# EAGLE design smartBadgeN (EAGLE 9.4.2)
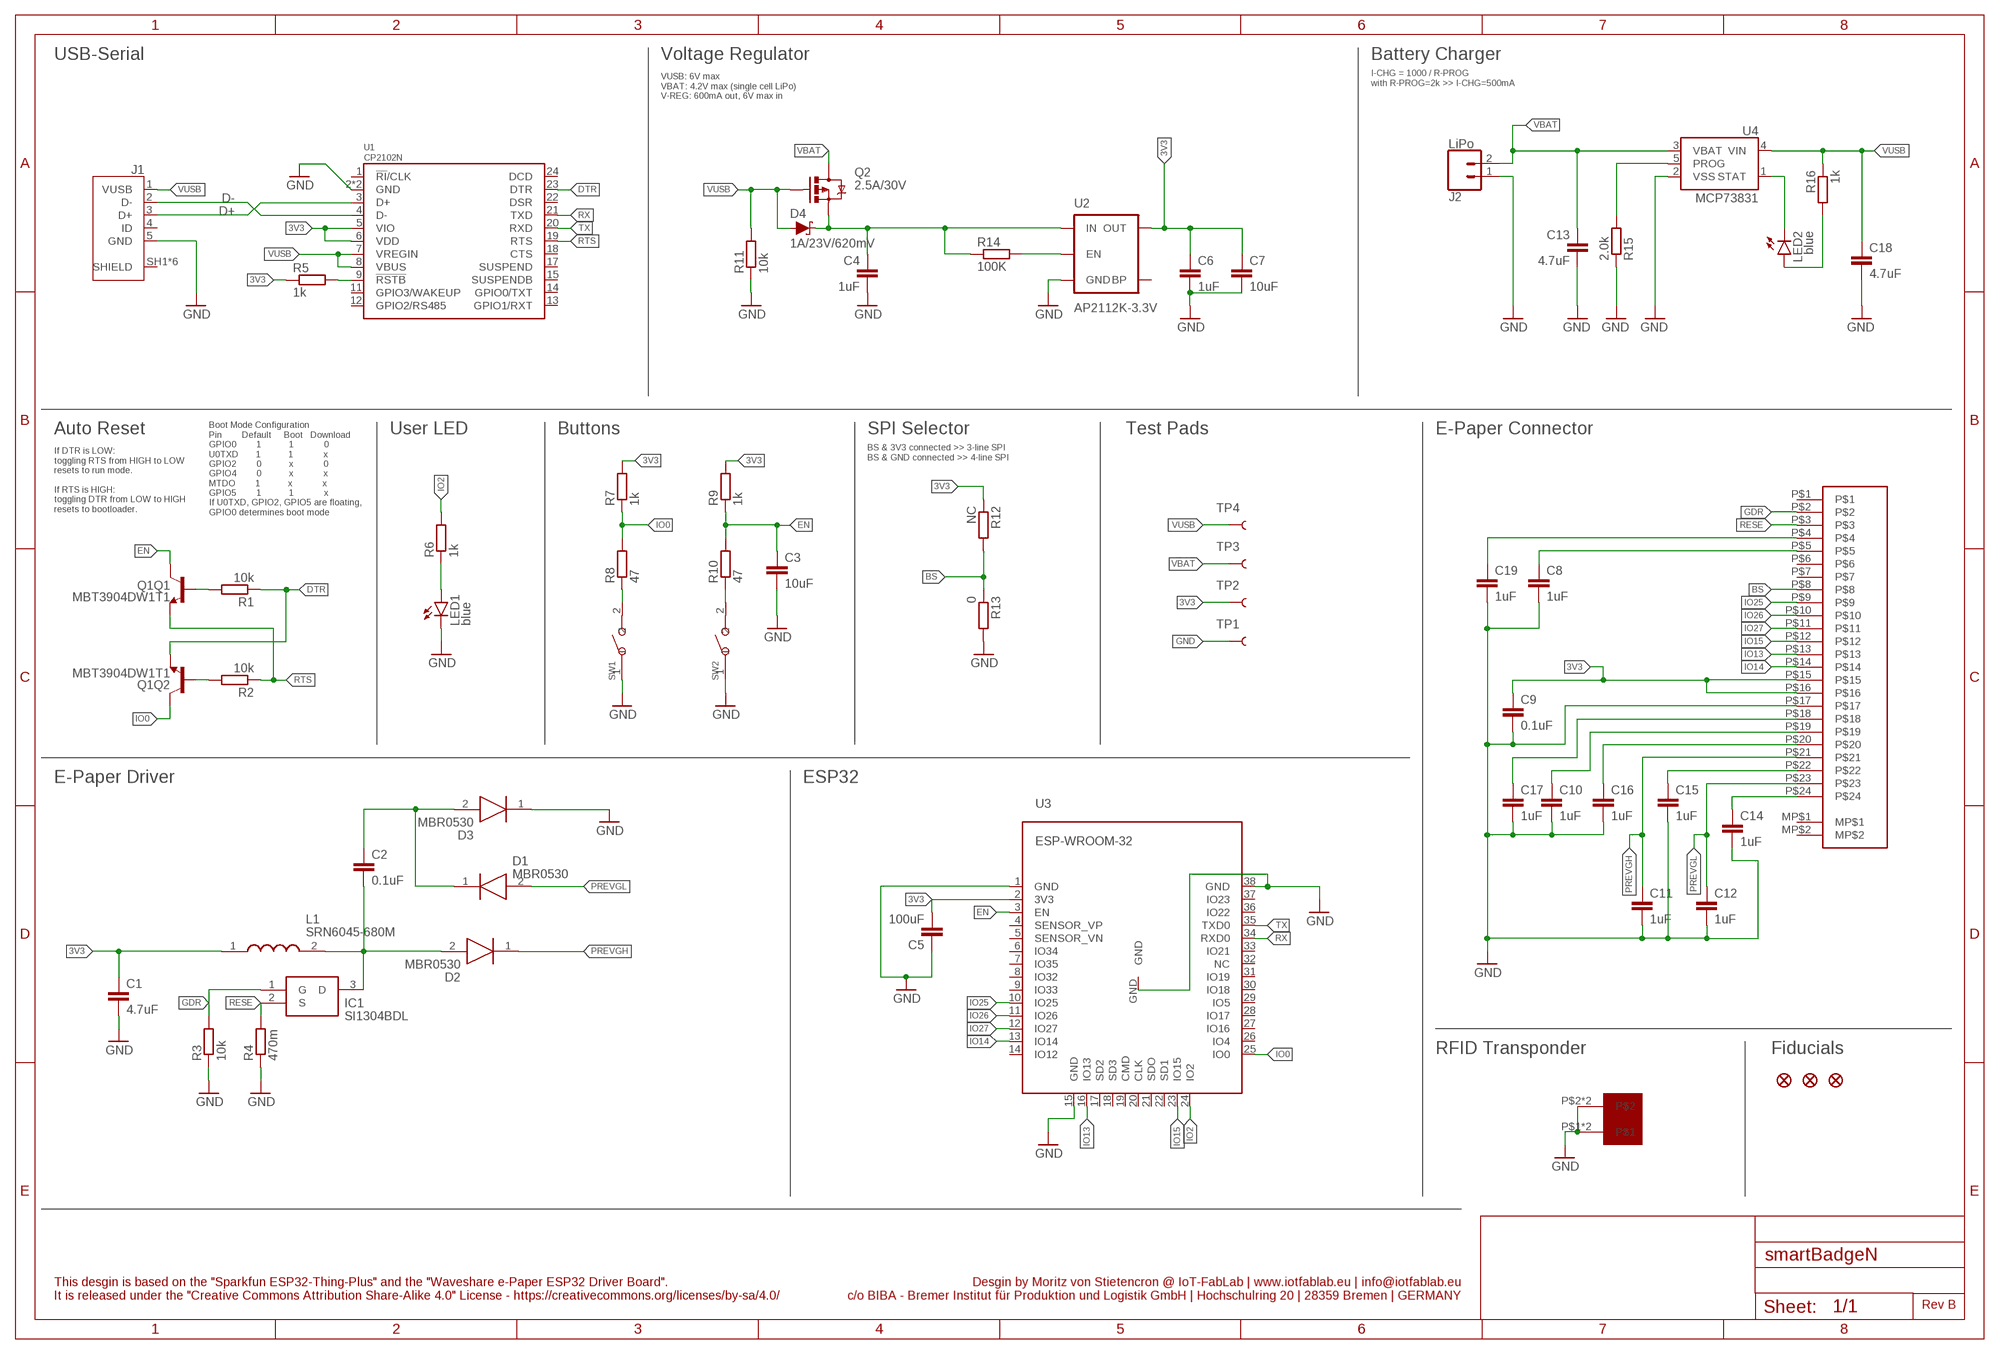
[diagram p0: schematic, sheet 1]

## Parts
C1  4.7uF  C-EUC0603  [C0603]
C2  0.1uF  C-EUC0603  [C0603]
C3  10uF  C-EUC0603  [C0603]
C4  1uF  C-EUC0603  [C0603]
C5  100uF  C-EUC1206  [C1206]
C6  1uF  C-EUC0603  [C0603]
C7  10uF  C-EUC0603  [C0603]
C8  1uF  C-EUC0603  [C0603]
C9  0.1uF  C-EUC0603  [C0603]
C10  1uF  C-EUC0603  [C0603]
C11  1uF  C-EUC0603  [C0603]
C12  1uF  C-EUC0603  [C0603]
C13  4.7uF  C-EUC0603  [C0603]
C14  1uF  C-EUC0603  [C0603]
C15  1uF  C-EUC0603  [C0603]
C16  1uF  C-EUC0603  [C0603]
C17  1uF  C-EUC0603  [C0603]
C18  4.7uF  C-EUC0603  [C0603]
C19  1uF  C-EUC0603  [C0603]
D1  MBR0530  [SOD3716X135N]
D2  MBR0530  [SOD3716X135N]
D3  MBR0530  [SOD3716X135N]
D4  1A/23V/620mV  DIODE-SCHOTTKY-BAT20J  [SOD-323]
EPD  MOLEX-FPC-CONN-24X0.5  [MOLEX-0512812494]
FD1  FIDUCIAL1X2  [FIDUCIAL-1X2]
FD2  FIDUCIAL1X2  [FIDUCIAL-1X2]
FD3  FIDUCIAL1X2  [FIDUCIAL-1X2]
IC1  SI1304BDL  SI1304BDL-T1-E3  [SOT65P210X110-3N]
J1  10118192-0001LF  [AMPHENOL_10118192-0001LF]
J2  LiPo  CONN_02-JST-2MM-SMT  [JST-2-SMD]
L1  SRN6045-680M  [INDPM6060X470N]
LED1  blue  LEDCHIP-LED0603  [CHIP-LED0603]
LED2  blue  LEDCHIP-LED0603  [CHIP-LED0603]
Q1  MBT3904DW1T1  TRANS_NPN_DUAL-MBT3904DW1T1  [SC70-6]
Q2  2.5A/30V  MOSFET-PCHANNELDMG2307L  [SOT23-3@1]
R1  10k  R-EU_R0603  [R0603]
R2  10k  R-EU_R0603  [R0603]
R3  10k  R-EU_R0603  [R0603]
R4  470m  R-EU_R0603  [R0603]
R5  1k  R-EU_R0603  [R0603]
R6  1k  R-EU_R0603  [R0603]
R7  1k  R-EU_R0603  [R0603]
R8  47  R-EU_R0603  [R0603]
R9  1k  R-EU_R0603  [R0603]
R10  47  R-EU_R0603  [R0603]
R11  10k  R-EU_R0603  [R0603]
R12  NC  R-EU_R0603  [R0603]
R13  0  R-EU_R0603  [R0603]
R14  100K  R-EU_R0603  [R0603]
R15  2.0k  R-EU_R0603  [R0603]
R16  1k  R-EU_R0603  [R0603]
RFID1  LXMS21ACMF-183  [LXMS21ACMF-183]
SW1  SMD-BUTTON(2P-3.0X2.5X1.2+0.4MM)-B3U-1000P-2P-SMD  [SW2-2.6-3.0X2.5X1.2+0.4MM]
SW2  SMD-BUTTON(2P-3.0X2.5X1.2+0.4MM)-B3U-1000P-2P-SMD  [SW2-2.6-3.0X2.5X1.2+0.4MM]
TP1  TEST-POINT3  [PAD.03X.03]
TP2  TEST-POINT3  [PAD.03X.03]
TP3  TEST-POINT3  [PAD.03X.03]
TP4  TEST-POINT3  [PAD.03X.03]
U1  CP2102N  [QFN24]
U2  AP2112K-3.3V  V_REG_LDOSMD  [SOT23-5]
U3  ESP-WROOM-32  [ESP-WROOM-32]
U4  MCP73831  [SOT23-5]

## Nets
3V3 [VDD]: C1.1 C5.2 C6.1 C7.1 C9.1 EPD.P$15 EPD.P$16 L1.1 R5.1 R7.2 R9.2 R12.1 TP2.P$1 U1.5(VIO) U1.6(VDD) U2.5(OUT) U3.2(3V3)
BS: EPD.P$8 R12.2 R13.1
BTN1: R10.1 SW2.2
CHG: LED2.C U4.1(STAT)
D+: J1.3(D+) U1.3(D+)
D-: J1.2(D-) U1.4(D-)
DTR: Q1.1(Q2:E) R1.1 U1.23(DTR)
EN: C3.1 Q1.3(Q1:C) R9.1 R10.2 U3.3(EN)
EN1: R14.2 U2.3(EN)
GDR: EPD.P$2 IC1.1(G) R3.2
GND [gnd]: C1.2 C3.2 C4.2 C5.1 C6.2 C7.2 C8.2 C9.2 C10.2 C11.2 C12.2 C13.2 C14.2 C15.2 C16.2 C17.2 C18.2 C19.2 D3.1(K) EPD.P$17 J1.5(GND) J2.1 LED1.C R3.1 R4.1 R11.1 R13.2 R15.1 RFID1.P$1 RFID1.P$2 RFID1.P$3 RFID1.P$4 SW1.1 SW2.1 TP1.P$1 U1.2(GND) U1.PAD(GND) U2.2(GND) U3.1(GND) U3.15(GND) U3.38(GND) U3.GND U4.2(VSS)
IO0: Q1.6(Q2:C) R7.1 R8.2 U3.25(IO0)
IO2: R6.2 U3.24(IO2)
IO13: EPD.P$13 U3.16(IO13)
IO14: EPD.P$14 U3.13(IO14)
IO15: EPD.P$12 U3.23(IO15)
IO25: EPD.P$9 U3.10(IO25)
IO26: EPD.P$10 U3.11(IO26)
IO27: EPD.P$11 U3.12(IO27)
N$1: R5.2 U1.9(!RSTB)
N$2: C17.1 EPD.P$18
N$3: C10.1 EPD.P$19
N$4: LED2.A R16.2
N$5: R15.2 U4.5(PROG)
N$6: Q1.5(Q1:B) R1.2
N$7: LED1.A R6.1
N$8: C19.1 EPD.P$4
N$9: C8.1 EPD.P$5
N$10: C16.1 EPD.P$20
N$12: C15.1 EPD.P$22
N$14: C14.1 EPD.P$24
N$17: C2.1 D1.1(K) D3.2(A)
N$18: C2.2 D2.2(A) IC1.3(D) L1.2
N$21: R8.1 SW1.2
N$22: Q1.2(Q2:B) R2.2
PREVGH: C11.1 D2.1(K) EPD.P$21
PREVGL: C12.1 D1.2(A) EPD.P$23
RESE: EPD.P$3 IC1.2(S) R4.2
RTS: Q1.4(Q1:E) R2.1 U1.19(RTS)
RX: U1.21(TXD) U3.34(RXD0)
TX: U1.20(RXD) U3.35(TXD0)
VBAT [VDD]: C13.1 J2.2 Q2.3(D) TP3.P$1 U4.3(VBAT)
VIN [VDD]: C4.1 D4.C Q2.2(S) R14.1 U2.1(IN)
VUSB [VDD]: C18.1 D4.A J1.1(VUSB) Q2.1(G) R11.2 R16.1 TP4.P$1 U1.7(VREGIN) U1.8(VBUS) U4.4(VIN)
Unconnected: EPD.MP$1 EPD.MP$2 EPD.P$1 EPD.P$6 EPD.P$7 J1.4(ID) J1.SH1(SHIELD) J1.SH2(SHIELD) J1.SH3(SHIELD) J1.SH4(SHIELD) J1.SH5(SHIELD) J1.SH6(SHIELD) U1.1(!RI!/CLK) U1.11(GPIO3/WAKEUP) U1.12(GPIO2/RS485) U1.13(GPIO1/RXT) U1.14(GPIO0/TXT) U1.15(SUSPENDB) U1.17(SUSPEND) U1.18(CTS) U1.22(DSR) U1.24(DCD) U2.4(BP) U3.4(SENSOR_VP) U3.5(SENSOR_VN) U3.6(IO34) U3.7(IO35) U3.8(IO32) U3.9(IO33) U3.14(IO12) U3.17(SD2) U3.18(SD3) U3.19(CMD) U3.20(CLK) U3.21(SDO) U3.22(SD1) U3.26(IO4) U3.27(IO16) U3.28(IO17) U3.29(IO5) U3.30(IO18) U3.31(IO19) U3.32(NC) U3.33(IO21) U3.36(IO22) U3.37(IO23)

## Notes on the sheet
- USB-Serial | Voltage Regulator | Battery Charger
- VUSB: 6V max
  VBAT: 4.2V max (single cell LiPo)
  V-REG: 600mA out, 6V max in
- I-CHG = 1000 / R-PROG
  with R-PROG=2k >> I-CHG=500mA
- Boot Mode Configuration
  Pin        Default     Boot   Download
  GPIO0        1           1            0
  U0TXD       1           1            x
  GPIO2        0           x            0
  GPIO4        0           x            x
  MTDO        1           x            x
  GPIO5        1           1            x
  If U0TXD, GPIO2, GPIO5 are floating, 
  GPIO0 determines boot mode
- Auto Reset | User LED | Buttons | SPI Selector | Test Pads | E-Paper Connector
- If DTR is LOW:
  toggling RTS from HIGH to LOW 
  resets to run mode.
  
  If RTS is HIGH:
  toggling DTR from LOW to HIGH
  resets to bootloader.
- BS & 3V3 connected >> 3-line SPI
  BS & GND connected >> 4-line SPI
- E-Paper Driver | ESP32
- RFID Transponder | Fiducials
- This desgin is based on the "Sparkfun ESP32-Thing-Plus" and the "Waveshare e-Paper ESP32 Driver Board".
  It is released under the "Creative Commons Attribution Share-Alike 4.0" License - https://creativecommons.org/licenses/by-sa/4.0/
- Desgin by Moritz von Stietencron @ IoT-FabLab | www.iotfablab.eu | info@iotfablab.eu
  c/o BIBA - Bremer Institut für Produktion und Logistik GmbH | Hochschulring 20 | 28359 Bremen | GERMANY
- Rev B

## Library data of the parts
C1-C19 = resistor:C-EU: CAPACITOR, European symbol
D1-D3 = SamacSys_Parts:MBR0530: ON SEMICONDUCTOR - MBR0530 - DIODE, SCHOTTKY, 0.5A, 30V, SOD-123 Source: Datasheet <https://www.mouser.com/datasheet/2/308/MBR0530-1301245.pdf>; DESCRIPTION: ON SEMICONDUCTOR - MBR0530 - DIODE, SCHOTTKY, 0.5A, 30V, SOD-123; HEIGHT: 1.35mm; MANUFACTURER_NAME: ON Semiconductor; MANUFACTURER_PART_NUMBER: MBR0530; MOUSER_PART_NUMBER: 512-MBR0530
D4 = SparkFun-DiscreteSemi:DIODE-SCHOTTKY: Schottky diode A Schottky diode is a semiconductor diode which has a low forward voltage drop and a very fast switching action.; PROD_ID: DIO-11623
EPD = BIBA:MOLEX-FPC-CONN-24X0.5
FD1-FD3 = SparkFun-Aesthetics:FIDUCIAL: Fiducial Alignment Points Point-of-reference for pick-and-place machines and other optical instruments.
IC1 = SamacSys_Parts:SI1304BDL-T1-E3: SI1304BDL-T1-E3, N-channel MOSFET Transistor 0.85 A 30 V, 3-Pin SC-70 Source: Datasheet <https://componentsearchengine.com/Datasheets/1/SI1304BDL-T1-E3.pdf>; DESCRIPTION: SI1304BDL-T1-E3, N-channel MOSFET Transistor 0.85 A 30 V, 3-Pin SC-70; HEIGHT: 1.1mm; MANUFACTURER_NAME: Vishay; MANUFACTURER_PART_NUMBER: SI1304BDL-T1-E3; MOUSER_PART_NUMBER: 781-SI1304BDL-E3; MOUSER_PRICE-STOCK: https://www.mouser.com/Search/Refine.aspx?Keyword=781-SI1304BDL-E3
J1 = 10118192-0001LF:10118192-0001LF: Single Port 5 Contact Horizontal Right Angle Shielded Micro B USB 2.0 Connector; AVAILABILITY: Unavailable; DESCRIPTION: Single Port 5 Contact Horizontal Right Angle Shielded Micro B USB 2.0 Connector; MF: Amphenol ICC; MP: 10118192-0001LF; PACKAGE: None; PRICE: None
J2 = SparkFun-Connectors:CONN_02: Multi connection point. Often used as Generic Header-pin footprint for 0.1 inch spaced/style header connections On any of the 0.1 inch spaced packages, you can populate with these: Break Away Headers - Straight <https://www.sparkfun.com/products/116> (PRT-00116) Break Away Male Headers - Right Angle <https://www.sparkfun.com/products/553> (PRT-00553) Female Headers <https://www.sparkfun.com/products/115> (PRT-00115) Break Away Headers - Machine Pin <https://www.sparkfun.com/products/117> (PRT-00117) Break Away Female Headers - Swiss Machine Pin <https://www.sparkfun.com/products/743> (PRT-00743) For SCREWTERMINALS and SPRING TERMINALS visit here: Screw Terimnals on SparkFun.com <https://www.sparkfun.com/search/results?term=Screw+Terminals> (5mm/3.5mm/2.54mm spacing) This device is also useful as a general connection point to wire up your design to another part of your project. Our various solder wires solder well into these plated through hole pads. Hook-Up Wire - Assortment (Stranded, 22 AWG) <https://www.sparkfun.com/products/11375> (PRT-11375) Hook-Up Wire - Assortment (Solid Core, 22 AWG) <https://www.sparkfun.com/products/11367> (PRT-11367) View the entire wire category on our website here <https://www.sparkfun.com/categories/141> Special notes: Molex polarized connector foot print use with: PRT-08233 with associated crimp pins and housings. 2.54_SCREWTERM for use with PRT-10571. 3.5mm Screw Terminal footprints for PRT-08084 5mm Screw Terminal footprints for use with PRT-08432; PROD_ID: CONN-11443
L1 = SamacSys_Parts:SRN6045-680M: Bourns SRN6045 Series Type 6045 Shielded Wire-wound SMD Inductor with a Ferrite Core, 68 H +/-20% Wire-Wound 1A Idc Source: Datasheet <https://www.mouser.de/datasheet/2/54/rn6045-1391386.pdf>; DESCRIPTION: Bourns SRN6045 Series Type 6045 Shielded Wire-wound SMD Inductor with a Ferrite Core, 68 H +/-20% Wire-Wound 1A Idc; HEIGHT: 4.7mm; MANUFACTURER_NAME: Bourns; MANUFACTURER_PART_NUMBER: SRN6045-680M
LED1 LED2 = led:LED: LED OSRAM: - CHIPLED LG R971, LG N971, LY N971, LG Q971, LY Q971, LO R971, LY R971 LH N974, LH R974 LS Q976, LO Q976, LY Q976 LO Q996 - Hyper CHIPLED LW Q18S LB Q993, LB Q99A, LB R99A - SideLED LS A670, LO A670, LY A670, LG A670, LP A670 LB A673, LV A673, LT A673, LW A673 LH A674 LY A675 LS A676, LA A676, LO A676, LY A676, LW A676 LS A679, LY A679, LG A679 - Hyper Micro SIDELED® LS Y876, LA Y876, LO Y876, LY Y876 LT Y87S - SmartLED LW L88C, LW L88S LB L89C, LB L89S, LG L890 LS L89K, LO L89K, LY L89K LS L896, LA L896, LO L896, LY L896 - TOPLED LS T670, LO T670, LY T670, LG T670, LP T670 LSG T670, LSP T670, LSY T670, LOP T670, LYG T670 LG T671, LOG T671, LSG T671 LB T673, LV T673, LT T673, LW T673 LH T674 LS T676, LA T676, LO T676, LY T676, LB T676, LH T676, LSB T676, LW T676 LB T67C, LV T67C, LT T67C, LS T67K, LO T67K, LY T67K, LW E67C LS E67B, LA E67B, LO E67B, LY E67B, LB E67C, LV E67C, LT E67C LW T67C LS T679, LY T679, LG T679 LS T770, LO T770, LY T770, LG T770, LP T770 LB T773, LV T773, LT T773, LW T773 LH T774 LS E675, LA E675, LY E675, LS T675 LS T776, LA T776, LO T776, LY T776, LB T776 LHGB T686 LT T68C, LB T68C - Hyper Mini TOPLED® LB M676 - Mini TOPLED Santana® LG M470 LS M47K, LO M47K, LY M47K Source: http://www.osram.convergy.de LUXEON: - LUMILED® LXK2-PW12-R00, LXK2-PW12-S00, LXK2-PW14-U00, LXK2-PW14-V00 LXK2-PM12-R00, LXK2-PM12-S00, LXK2-PM14-U00 LXK2-PE12-Q00, LXK2-PE12-R00, LXK2-PE12-S00, LXK2-PE14-T00, LXK2-PE14-U00 LXK2-PB12-K00, LXK2-PB12-L00, LXK2-PB12-M00, LXK2-PB14-N00, LXK2-PB14-P00, LXK2-PB14-Q00 LXK2-PR12-L00, LXK2-PR12-M00, LXK2-PR14-Q00, LXK2-PR14-R00 LXK2-PD12-Q00, LXK2-PD12-R00, LXK2-PD12-S00 LXK2-PH12-R00, LXK2-PH12-S00 LXK2-PL12-P00, LXK2-PL12-Q00, LXK2-PL12-R00 Source: www.luxeon.com KINGBRIGHT: KA-3528ASYC Source: www.kingbright.com
Q1 = SparkFun-DiscreteSemi:TRANS_NPN_DUAL: Dual NPN Transistors in Single Package The MBT3904W1 puts two general purpose 3904 NPN transistors in a single package. Datasheet <http://www.onsemi.com/pub_link/Collateral/MBT3904DW1T1-D.PDF> SparkFun Products: SparkFun ESP32 Thing <https://www.sparkfun.com/products/13907>; PROD_ID: TRANS-13337
Q2 = SparkFun-DiscreteSemi:MOSFET-PCHANNEL: Generic PMOSFET IRLML2244 - TRANS-11153 (SOT-23 -20V -4.3A) (1.Gate 2.Source 3.Drain) FQP27P06 - COM-10349 <http://www.sparkfun.com/products/10349> (TO-220 -60V -27A) (1.Gate 2.Source 3.Drain); PROD_ID: TRANS-11308
R1-R16 = resistor:R-EU_: RESISTOR, European symbol
RFID1 = BIBA:LXMS21ACMF-183
SW1 SW2 = OPL_Switch:SMD-BUTTON(2P-3.0X2.5X1.2+0.4MM): 311020047; MPN: B3U-1000P-2P-SMD; VALUE: B3U-1000P-2P-SMD
TP1-TP4 = SparkFun-Connectors:TEST-POINT: SparkFun Test Points Bare copper test points for troubleshooting or In-Circuit-Testing. These are used by our Production team for verifying production board runs using pogo-pins on test beds. SparkFun Products: SparkFun LSM9DS1 Breakout <https://www.sparkfun.com/products/13284> SparkFun PSOC <https://www.sparkfun.com/products/13714> SparkFun Load Cell Amplifier <https://www.sparkfun.com/products/13879>
U1 = SparkFun-IC-Comms:CP2102N; PROD_ID: IC-14020
U2 = SparkFun-PowerIC:V_REG_LDO: Voltage Regulator LDO Standard 150mA LDO voltage regulator in SOT-23 layout. Micrel part MIC5205. BP (by-pass) pin is used to lower output noise with 470pF cap.; PROD_ID: VREG-12457
U3 = esp32:ESP-WROOM-32
U4 = SparkFun-PowerIC:MCP73831: Miniature single cell, fully integrated Li-Ion, Li-polymer charge management controller http://ww1.microchip.com/downloads/en/DeviceDoc/20001984g.pdf IC-09995; PROD_ID: IC-09995

## Net classes
0 default: width 0.127 mm
1 gnd: width 0.305 mm
2 VDD: width 0.305 mm

## Board
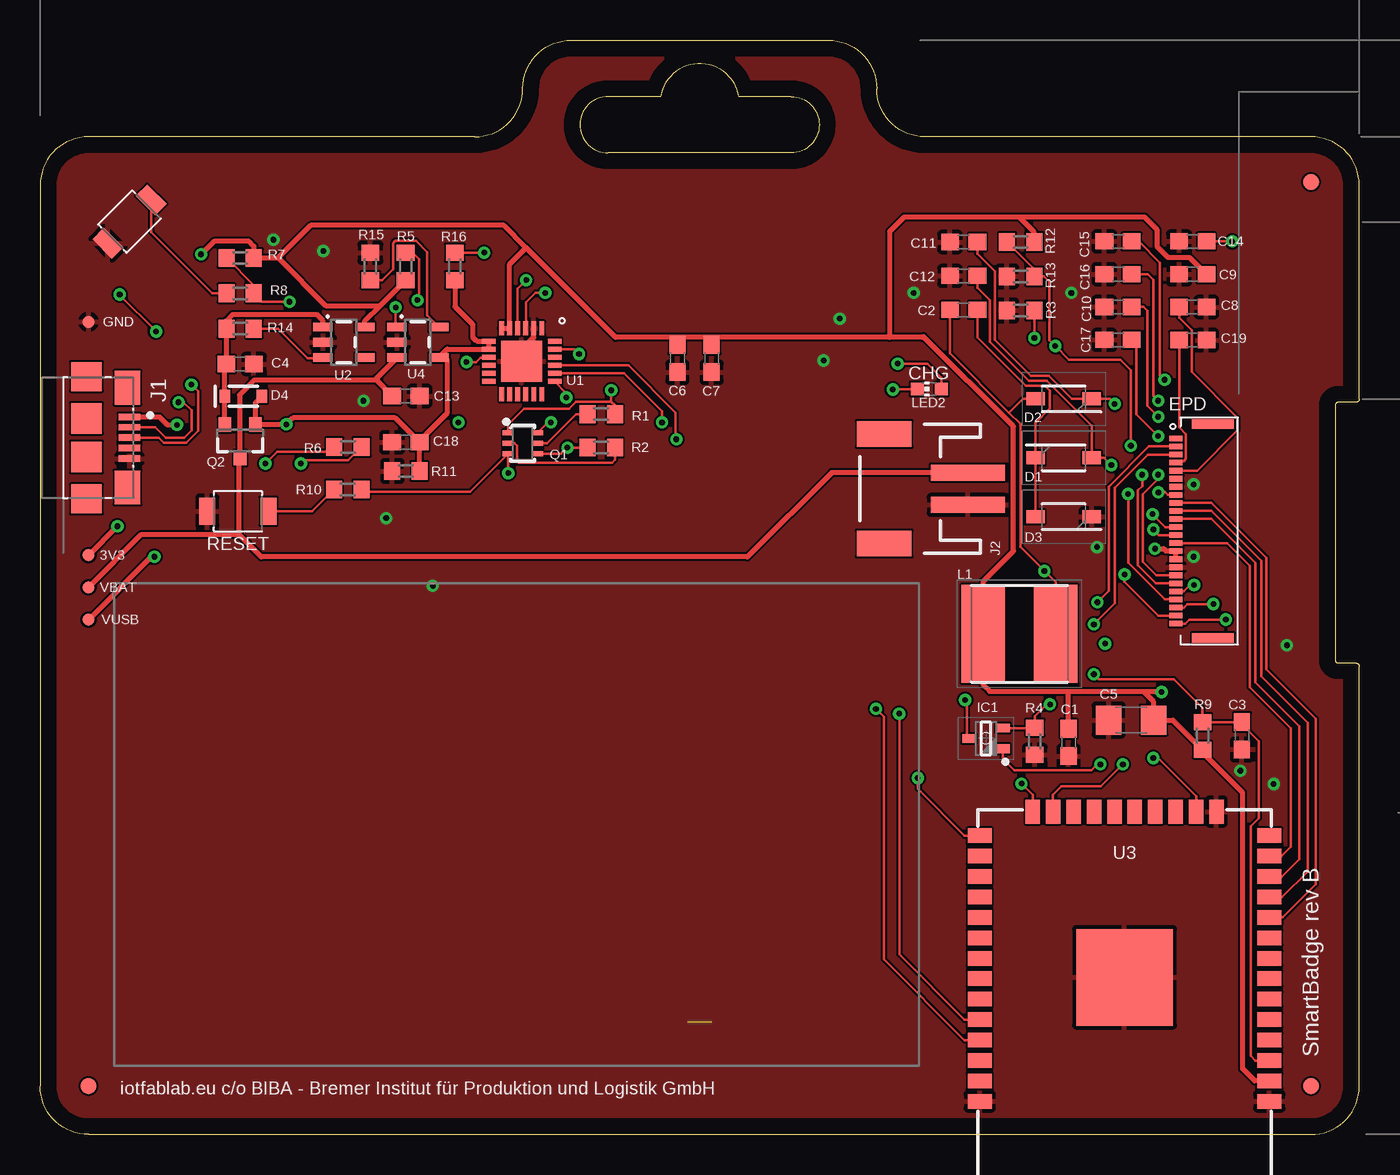
[diagram p1: board, top side]
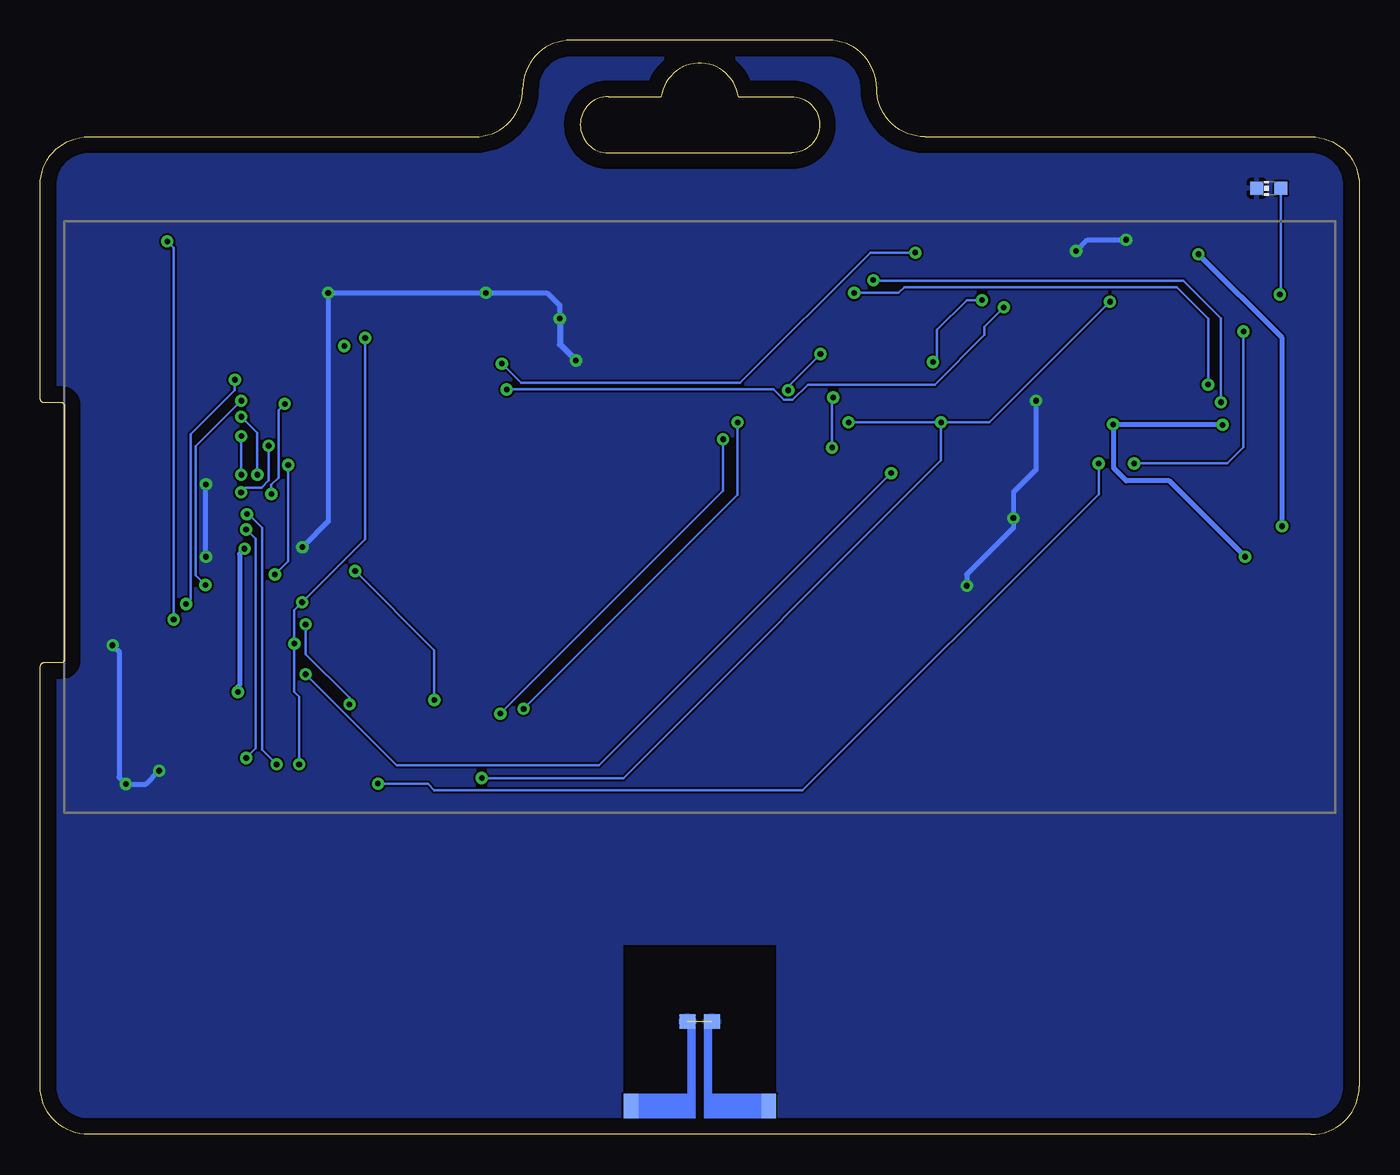
[diagram p2: board, bottom side, seen from below]

Size 82 x 68 mm. Coordinates in mm from the lower left corner, seen from the top.
Outline: 3,0 79,0 arc90 82,3 82,29.1 arc90 81.8,29.3 80.7,29.3 arc-90 80.5,29.5 80.5,45.3 arc-90 80.7,45.5 81.8,45.5 arc90 82,45.7 82,59 arc90 79,62 55,62 arc-90 52,65 arc90 49,68 33,68 arc90 30,65 arc-90 27,62 3,62 arc90 0,59 0,3 arc90 3,0
Outline: 46.68,61 35.3,61 arc-180 35.3,64.5 38.6,64.5 arc-163 43.4,64.5 46.68,64.5 arc-180 46.68,61
Copper layers (1*16): Top 0.035mm / dielectric 1.5mm / Bottom 0.035mm
Design rules "default *": minimum track width 6mil, minimum drill 0.35mm, track to track 5mil, track to pad 5mil, pad to pad 5mil, via to via 5mil, smd to smd 5mil, copper to edge 40mil, drill to drill 6mil, minimum pad ring 10mil, minimum via ring 8mil, stop-mask expansion 2.5mil, vias tented up to drill 20mil, thermal gap 10mil

### Footprints (pad centres in the part's own frame; a part is rotated, then mirrored left to right if it is on the bottom)
C0603 = smd 1.1 x 1: 1 -0.85,0; 2 0.85,0
C1206 = smd 1.6 x 1.8: 1 -1.4,0; 2 1.4,0
SOD3716X135N = smd 1.15 x 0.8: 1 -1.75,0; 2 1.75,0
SOD-323 = smd 0.63 x 0.83: A 1.15,0; C -1.15,0
MOLEX-0512812494 = smd 2.6 x 0.6: MP$1 0,6.65; MP$2 0,-6.65 | smd 0.8 x 0.35: P$1 -2.3,5.75; P$2 -2.3,5.25; P$3 -2.3,4.75; P$4 -2.3,4.25; P$5 -2.3,3.75; P$6 -2.3,3.25; P$7 -2.3,2.75; P$8 -2.3,2.25; P$9 -2.3,1.75; P$10 -2.3,1.25; P$11 -2.3,0.75; P$12 -2.3,0.25; P$13 -2.3,-0.25; P$14 -2.3,-0.75; P$15 -2.3,-1.25; P$16 -2.3,-1.75; P$17 -2.3,-2.25; P$18 -2.3,-2.75; P$19 -2.3,-3.25; P$20 -2.3,-3.75; P$21 -2.3,-4.25; P$22 -2.3,-4.75; P$23 -2.3,-5.25; P$24 -2.3,-5.75
FIDUCIAL-1X2 = smd 1 x 1: 1 0,0
SOT65P210X110-3N = smd 0.85 x 0.55: 1 -1.05,0.65; 2 -1.05,-0.65; 3 1.05,0
AMPHENOL_10118192-0001LF = smd 0.4 x 1.35: 1 -1.3,0; 2 -0.65,0; 3 0,0; 4 0.65,0; 5 1.3,0 | smd 2.1 x 1.6: SH1 -3.1,-0.125; SH2 3.1,-0.125 | smd 1.8 x 1.9: SH3 -3.8,-2.675; SH6 3.8,-2.675 | smd 1.9 x 1.9: SH4 -1.2,-2.675; SH5 1.2,-2.675
JST-2-SMD = smd 1 x 4.6: 1 -1,-3.7; 2 1,-3.7 | smd 1.6 x 3.4: NC1 -3.4,1.5; NC2 3.4,1.5
INDPM6060X470N = smd 2.7 x 6.1: 1 -2.25,0; 2 2.25,0
CHIP-LED0603 = smd 0.8 x 0.8: A 0,-0.75; C 0,0.75
SC70-6 = smd 0.3 x 0.66: 1 -0.65,-0.92; 2 0,-0.92; 3 0.65,-0.92; 4 0.65,0.92; 5 0,0.92; 6 -0.65,0.92
SOT23-3@1 = smd 0.8 x 0.9: 1 -0.95,-1; 2 0.95,-1; 3 0,1.1
R0603 = smd 1 x 1.1: 1 -0.85,0; 2 0.85,0
LXMS21ACMF-183 = smd 1 x 0.9: P$1 -0.75,0; P$2 0.75,0 | smd 0.9 x 1.5: P$3 -4.3,5.25; P$4 4.25,5.25
SW2-2.6-3.0X2.5X1.2+0.4MM = smd 1 x 1.7: 1 -1.9,0; 2 1.9,0
PAD.03X.03 = smd 0.762 x 0.762: P$1 0,0
QFN24 = smd 0.85 x 0.3: 1 -2.05,1.25; 2 -2.05,0.75; 3 -2.05,0.25; 4 -2.05,-0.25; 5 -2.05,-0.75; 6 -2.05,-1.25; 13 2.05,-1.25; 14 2.05,-0.75; 15 2.05,-0.25; 16 2.05,0.25; 17 2.05,0.75; 18 2.05,1.25 | smd 0.3 x 0.85: 7 -1.25,-2.05; 8 -0.75,-2.05; 9 -0.25,-2.05; 10 0.25,-2.05; 11 0.75,-2.05; 12 1.25,-2.05; 19 1.25,2.05; 20 0.75,2.05; 21 0.25,2.05; 22 -0.25,2.05; 23 -0.75,2.05; 24 -1.25,2.05 | smd 2.55 x 2.55: PAD 0,0
SOT23-5 = smd 0.55 x 1.2: 1 -0.95,-1.3; 2 0,-1.3; 3 0.95,-1.3; 4 0.95,1.3; 5 -0.95,1.3
ESP-WROOM-32 = smd 0.9 x 1.5: 1 7.7,9; 2 6.43,9; 3 5.16,9; 4 3.89,9; 5 2.62,9; 6 1.35,9; 7 0.08,9; 8 -1.19,9; 9 -2.46,9; 10 -3.73,9; 11 -5,9; 12 -6.27,9; 13 -7.54,9; 14 -8.81,9; 25 -8.81,-9; 26 -7.54,-9; 27 -6.27,-9; 28 -5,-9; 29 -3.73,-9; 30 -2.46,-9; 31 -1.19,-9; 32 0.08,-9; 33 1.35,-9; 34 2.62,-9; 35 3.89,-9; 36 5.16,-9; 37 6.43,-9; 38 7.7,-9 | smd 1.5 x 0.9: 15 -10.3,5.715; 16 -10.3,4.445; 17 -10.3,3.175; 18 -10.3,1.905; 19 -10.3,0.635; 20 -10.3,-0.635; 21 -10.3,-1.905; 22 -10.3,-3.175; 23 -10.3,-4.445; 24 -10.3,-5.715 | smd 6 x 6: GND 0,0

### Placement (x,y rotation side)
C1  63.93,24.36 270 top
C2  57.41,51.24 180 top
C3  74.7,24.78 270 top
C4  12.43,47.88 0 top
C5  67.82,25.75 0 top
C6  39.61,48.23 270 top
C7  41.73,48.23 270 top
C8  71.65,51.42 0 top
C9  71.65,53.46 180 top
C10  67,51.42 180 top
C11  57.41,55.46 180 top
C12  57.41,53.36 180 top
C13  22.73,45.89 0 top
C14  71.65,55.5 180 top
C15  67,55.5 180 top
C16  67,53.46 180 top
C17  67,49.38 180 top
C18  22.73,43.02 180 top
C19  71.65,49.37 0 top
D1  63.62,42.05 0 top
D2  63.62,45.71 180 top
D3  63.62,38.39 180 top
D4  12.63,45.88 0 top
EPD  72.9,37.5 0 top
FD1  3,3 0 top
FD2  79.01,59.19 0 top
FD3  79,3 0 top
IC1  58.79,24.61 180 top
J1  5.55,43.3 270 top
J2  53.96,40.13 90 top
L1  60.88,31.11 0 top
LED1  5.62,58.8 90 bottom
LED2  55.27,46.33 90 top
Q1  30,42.95 270 top
Q2  12.43,43.13 180 top
R1  34.88,44.76 180 top
R2  34.88,42.68 0 top
R3  60.95,51.21 0 top
R4  61.83,24.44 90 top
R5  22.72,53.95 90 top
R6  19.13,42.72 0 top
R7  12.43,54.47 0 top
R8  12.43,52.27 0 top
R9  72.25,24.77 270 top
R10  19.12,40.09 0 top
R11  22.73,41.23 0 top
R12  60.95,55.46 180 top
R13  60.95,53.33 180 top
R14  12.43,50.08 0 top
R15  20.52,53.95 270 top
R16  25.78,53.95 90 top
RFID1  41,7.02 180 bottom
SW1  5.55,56.73 45 top
SW2  12.29,38.73 0 top
TP1  3,50.5 0 top
TP2  3,36 0 top
TP3  3,34 0 top
TP4  3,32 0 top
U1  29.93,48.05 270 top
U2  18.88,49.23 270 top
U3  67.41,9.76 270 top
U4  23.48,49.23 270 top

### Tracks (layer width: path | path; a pad name or v marks a point on that pad's centre or on a via)
3V3  (via drill 0.35)
  Top 0.305: U3.2 75.5,3.33 74.75,4.08 74.75,21.25 72.25,23.75 R9.2 70.42,25.75 C5.2 69.22,26.89 68.58,27.53 | 63.93,27.53 59.03,27.53 58.63,27.93 L1.1 58.63,34.38 60.5,36.25 60.5,44 54.91,49.59 54.87,49.54 52.8,49.54 | 63.93,27.53 68.58,27.53 | 14.78,54.47 R7.2 13.28,55.2 12.98,55.5 10.8,55.5 v10,54.7 | 14.78,54.47 17.75,51.5 21.12,51.5 | 21.12,51.5 R5.1 | U2.5 20.18,50.55 21.12,51.5 | U1.6 U1.5 29.18,54.08 30.2,55.1 | 52.8,49.54 41.8,49.54 | 41.8,49.54 39.6,49.54 | 39.6,49.54 35.77,49.54 30.2,55.1 | 14.78,54.47 16.82,56.5 28.83,56.5 30.21,55.12 30.2,55.1 | C6.1 39.6,49.54 | C7.1 41.73,49.47 41.8,49.54 | R12.1 61.8,56.06 60.86,57 | 60.86,57 53.7,57 52.8,56.1 52.8,49.54 | 60.86,57 68.66,57 69.44,56.21 69.44,55.17 70.12,54.49 71.47,54.49 C9.1 | C1.1 63.93,27.53 | v4.8,37.8 TP2.P$1 | EPD.P$16 EPD.P$15 70.58,36.27 69.97,36.27 69.84,36.4 v69.3,36.4 | 68.58,27.53 69.69,27.53 v69.71,27.5
  Bottom 0.305: v4.8,37.8 4.8,49.5 v10,54.7 | v69.3,36.4 69.61,36.09 69.61,27.9 69.71,27.8 v69.71,27.5
BS  (via drill 0.35)
  Top 0.152: R12.2 61.8,53.76 R13.1 62.4,53.33 62.73,53 62.73,49.37 v63.1,49 63.96,48.14 67.14,48.14 67.8,47.48 v67.8,42.8 | EPD.P$8 70.11,39.75 69.95,39.9 v69.51,39.9
  Bottom 0.152: v69.51,39.9 69.21,40.19 68.25,40.19 67.8,40.64 v67.8,42.8
BTN1
  Top 0.152: SW2.2 16.91,38.73 R10.1
CHG  (via drill 0.35)
  Top 0.152: U4.1 22.1,50.26 v22.1,51.4 | v53,46.3 54.49,46.3 LED2.C
  Bottom 0.152: v22.1,51.4 23.3,50.2 23.3,49.7 26.39,46.6 34.29,46.6 35.25,45.64 35.75,45.64 36.41,46.3 v53,46.3
D+  (via drill 0.35)
  Top 0.152: v9.4,46.6 9.81,46.19 9.81,43.72 9.08,42.99 7.69,42.99 7.38,43.3 J1.3 | v31.4,52.3 30.78,52.3 30.2,51.72 30.2,50.12 U1.3
  Bottom 0.152: v31.4,52.3 28.64,52.3 28.29,52.66 11.35,52.66 9.39,50.7 v9.39,46.61 v9.4,46.6
D-  (via drill 0.35)
  Top 0.152: J1.2 7.16,43.95 7.81,43.29 8.95,43.29 9.41,43.75 9.41,44.99 8.9,45.5 v8.6,45.5 | v30.21,53.09 29.68,52.56 U1.4
  Bottom 0.152: v8.6,45.5 8.6,50.71 10.95,53.06 30.21,53.06 v30.21,53.09
DTR  (via drill 0.35)
  Top 0.152: Q1.1 29.08,44.1 30.08,45.1 32.86,45.1 33.3,45.54 35.49,45.54 | R1.1 35.73,45.3 35.49,45.54 | U1.23 33.2,48.8 v33.5,48.5 | v35.5,46.25 35.5,45.55 35.49,45.54
  Bottom 0.152: v33.5,48.5 35.5,46.5 v35.5,46.25
EN  (via drill 0.35)
  Top 0.152: R10.2 20.11,39.94 26.72,39.94 Q1.3 29.08,41.12 v29.1,41.1 | v65.5,28.6 65.8,28.3 70.47,28.3 72.25,26.52 R9.1 C3.1 74.7,25.49 75.75,24.44 75.75,19.65 75.25,19.16 75.25,4.88 75.55,4.59 U3.3
  Bottom 0.152: v65.5,28.6 59.84,22.94 47.26,22.94 v29.1,41.1
EN1
  Top 0.152: R14.2 14.79,50.08 16.64,48.23 17.53,48.23 U2.3
GDR  (via drill 0.35)
  Top 0.152: IC1.1 59.84,23.36 60.56,22.64 65.33,22.64 65.7,23 v65.9,23 | R3.2 v61.8,49.5 | EPD.P$2 68.92,42.75 66.42,40.25 66.42,33.78 v65.72,33.08
  Bottom 0.152: v65.9,23 65.9,27.2 66.2,27.5 v66.2,30.5 v66.21,30.51 66.21,32.59 v65.72,33.08 61.8,37 v61.8,49.5
GND  (via drill 0.35)  (1 unrouted)
  Top 0.305: U1.2 30.67,49.53 29.93,48.79
  Top 0.381: U1.PAD 29.93,48.79
  Bottom 0.305: v17.6,54.9 16.9,55.6 v14.5,55.6 | v20.1,45.6 20.1,41.3 21.5,39.9 v21.5,38.3 21.5,37.7 24.4,34.8 v24.4,34.1 | v49.7,50.7 49.7,51.5 50.5,52.3 v54.3,52.3 v64.1,52.3 64.1,38.1 v65.7,36.5 | v77.5,30.4 77.1,30 77.1,22.2 v76.68,21.78 75.42,21.78 v74.6,22.6 | v71.7,35.9 v71.7,40.4
  Bottom 0.381: v49.7,50.7 49.7,49.1 v48.7,48.1
  pour Top: -2.2,69.9 -2.2,-2.5 84,-2.5 84,69.9
  pour Bottom: -4.3,71.7 -4.3,-7.9 86.5,-7.9 86.5,71.7
IO0  (via drill 0.35)
  Top 0.152: U3.25 57.46,18.57 54.55,21.48 v54.55,22.14 v54.56,22.15 | R7.1 13.28,52.77 R8.2 13.8,51.75 v15.5,51.75 | Q1.6 31.57,44.25 v31.75,44.25
  Bottom 0.152: v31.75,44.25 v26,44.25 | v26,44.25 23,44.25 v15.5,51.75 | v54.56,22.15 45.75,22.15 26,41.9 v26,44.25
IO2  (via drill 0.35)
  Top 0.152: R6.2 19.16,41.9 16.4,41.9 v16.2,41.7 | v61,21.8 61.7,21.1 U3.24
  Bottom 0.152: v16.2,41.7 16.2,39.8 34.6,21.4 57.5,21.4 57.9,21.8 v61,21.8
IO13  (via drill 0.35)
  Top 0.152: U3.16 71.86,21.01 69.46,23.4 v69.2,23.4 | v69.2,37.6 69.55,37.25 EPD.P$13
  Bottom 0.152: v69.2,23.4 68.61,23.99 68.61,37.01 v69.2,37.6
IO14
  Top 0.152: U3.13 77.17,17.3 77.75,17.89 77.75,25.25 75.2,27.8 75.2,35.35 73.8,36.75 EPD.P$14
IO15  (via drill 0.35)
  Top 0.152: U3.23 62.96,21.11 63.48,21.63 65.93,21.63 v67.3,23 | v69.15,38.55 69.95,37.75 EPD.P$12
  Bottom 0.152: v67.3,23 68.2,23.9 68.2,37.7 69.05,38.55 v69.15,38.55
IO25
  Top 0.152: U3.10 77.24,13.49 79.31,15.55 79.31,25.83 76.22,28.93 76.22,35.83 72.8,39.25 EPD.P$9
IO26
  Top 0.152: U3.11 77.22,14.76 78.79,16.33 78.79,25.58 75.9,28.47 75.9,35.65 72.8,38.75 EPD.P$10
IO27
  Top 0.152: U3.12 77.19,16.03 78.27,17.11 78.27,25.36 75.53,28.11 75.53,35.52 72.8,38.25 EPD.P$11
N$1  (via drill 0.35)
  Top 0.152: U1.9 27.86,48.28 27.36,48.28 27.08,48 v26.5,48 | v23.45,51.85 23.55,51.95 23.55,54.39 23.14,54.8 R5.2
  Bottom 0.152: v26.5,48 26.25,48.25 26.25,50 24.4,51.85 v23.45,51.85
N$2  (via drill 0.35)
  Top 0.152: v69.5,41 69.5,40.75 68.54,39.8 68.54,35.6 69.39,34.75 EPD.P$18 | v69.5,43.4 68.15,44.75 68.15,49.08 C17.1
  Bottom 0.152: v69.5,41 v69.5,43.4
N$3  (via drill 0.35)
  Top 0.152: v68.5,41 68.5,40.28 68.24,40.02 68.24,35.37 69.36,34.25 EPD.P$19 | C10.1 68.58,51.42 68.83,51.18 68.83,45.27 v69.5,44.6
  Bottom 0.152: v68.5,41 68.5,43.6 v69.5,44.6
N$4  (via drill 0.35)
  Top 0.152: R16.2 v27.6,54.8 | v53.3,47.9 55.15,47.9 56.02,47.03 LED2.A
  Bottom 0.152: v27.6,54.8 30.4,54.8 38.5,46.7 52.1,46.7 v53.3,47.9
N$5
  Top 0.152: R15.2 21.27,53.09 21.94,53.77 21.94,55.39 22.07,55.52 23.36,55.52 24.06,54.83 24.06,50.91 U4.5
N$6
  Top 0.152: Q1.5 31.51,42.95 33.32,44.76 R1.2
N$7  (via drill 0.35)
  Top 0.152: v14,41.7 14.72,42.42 17.98,42.42 R6.1 | v7.2,49.9 4.94,52.16 v4.94,52.2
  Bottom 0.152: v7.2,49.9 7.2,42.7 8.2,41.7 v14,41.7 | v4.94,52.2 4.87,52.2 LED1.A
N$8
  Top 0.152: EPD.P$4 70.7,41.85 71.09,41.85 71.23,41.98 71.23,43.52 70.8,43.95 C19.1
N$9
  Top 0.152: C8.1 70.8,50.74 71.58,49.97 71.58,47.4 74.43,44.55 74.43,43.76 71.92,41.25 EPD.P$5
N$10  (via drill 0.35)
  Top 0.152: EPD.P$20 71.09,33.75 71.5,34.15 v71.73,34.15 | v69.5,45.6 69.2,45.9 69.2,53.11 68.85,53.46 C16.1
  Bottom 0.152: v71.73,34.15 72.33,34.75 72.33,42.77 v69.5,45.6
N$12  (via drill 0.35)
  Top 0.152: EPD.P$22 71.09,32.75 71.31,32.97 v72.94,32.97 | v69.9,46.9 69.61,47.2 69.61,54.18 68.28,55.5 C15.1
  Bottom 0.152: v69.9,46.9 69.9,46.26 72.64,43.52 72.64,33.26 v72.94,32.97
N$14  (via drill 0.35)
  Top 0.152: EPD.P$24 71.19,31.75 71.45,32 v73.7,32 | v74.1,55.5 C14.1
  Bottom 0.152: v73.7,32 73.7,55.1 v74.1,55.5
N$17
  Top 0.152: D3.2 D1.1 61.88,44.21 62.78,45.12 62.78,46.2 62.45,46.54 61.26,46.54 58.26,49.54 C2.1
N$18  (via drill 0.35)
  Top 0.152: C2.2 56.56,48.53 60.23,44.86 | 60.23,44.86 60.92,44.17 60.92,36.52 v62.42,35.02 63.13,34.31 L1.2 | 60.23,44.86 61.08,45.71 D2.2 | IC1.3 57.62,24.73 57.62,26.88 v57.5,27
  Bottom 0.152: v57.5,27 57.5,30.1 v62.42,35.02
N$21
  Top 0.152: R8.1 10.68,52.27 6.89,56.06 SW1.2
N$22
  Top 0.152: R2.2 35.73,41.94 35.54,41.75 29.75,41.75 29.63,41.87 29.63,42.8 29.48,42.95 Q1.2
PREVGH  (via drill 0.35)
  Top 0.152: EPD.P$21 69.91,33.25 67.63,35.52 v67.63,39.8 | v66.8,45.4 66.49,45.71 D2.1 64.14,45.71 62.7,47.15 61.58,47.15 59.34,49.39 59.34,53.65 58.26,54.73 C11.1
  Bottom 0.152: v66.8,45.4 67.19,45.01 67.19,40.82 67.63,40.38 v67.63,39.8
PREVGL  (via drill 0.35)
  Top 0.152: EPD.P$23 69.5,32.25 67.41,34.34 v67.41,34.8 | v66.59,41.6 66.14,42.05 D1.2 65.38,44.04 62.57,46.84 61.46,46.84 59.04,49.26 59.04,51.84 58.26,52.61 C12.1
  Bottom 0.152: v67.41,34.8 66.59,35.62 v66.59,41.6
RESE  (via drill 0.35)
  Top 0.152: IC1.2 61.8,25.26 R4.2 61.83,25.98 62.57,26.73 v62.77,26.73 | v65.5,31.7 66.8,33 66.8,40.2 68.85,42.25 EPD.P$3
  Bottom 0.152: v65.5,31.7 65.5,29.86 62.77,27.13 v62.77,26.73
RTS  (via drill 0.35)
  Top 0.152: Q1.4 32.39,42.3 v32.77,42.69 R2.1 | U1.19 32.7,46.08 v32.7,45.8
  Bottom 0.152: v32.7,45.8 32.77,45.73 v32.77,42.69
RX  (via drill 0.35)
  Top 0.152: U3.34 57.46,7.14 53.4,11.2 v53.4,26.15 | v39.55,43.2 39.51,43.24 39.51,44.85 36.56,47.8 U1.21
  Bottom 0.152: v53.4,26.15 39.55,40 v39.55,43.2
TX  (via drill 0.35)
  Top 0.152: U3.35 57.46,5.87 52.45,10.88 52.45,25.95 v51.95,26.45 | v38.65,44.25 38.65,44.95 36.3,47.3 U1.20
  Bottom 0.152: v51.95,26.45 38.65,39.75 v38.65,44.25
VBAT
  Top 0.305: U4.3 20.93,47.03 20.93,46.84 C13.1 20.88,46.89 13.32,46.89 12.38,45.95 12.38,42.07 Q2.3 12.35,41.95 12.35,37.29 | 12.35,37.29 13.75,35.89 43.96,35.89 49.2,41.13 J2.2 | TP3.P$1 6.29,37.29 12.35,37.29
VIN
  Top 0.305: Q2.2 D4.C 11.48,47.78 C4.1 R14.1 11.58,50.58 11.97,50.97 17.17,50.97 17.58,50.56 U2.1
VUSB  (via drill 0.35)
  Top 0.305: R11.2 C18.1 | D4.A 13.38,45.48 Q2.1 v15.3,44.13 15.7,44.53 22.07,44.53 C18.1 | C18.1 23.58,43.12 25.28,44.82 25.28,48.18 25.18,48.28 U4.4 25.3,48.8 U1.8 U1.7 27.13,49.3 26.88,49.55 26.88,50.34 25.78,51.45 R16.1 | J1.1 7.4,44.6 7.9,44.1 v8.5,44.1 | TP4.P$1 6.9,35.9 v7.1,35.9
  Bottom 0.305: v8.5,44.1 15.27,44.1 | 15.27,44.1 v15.3,44.13 | v7.1,35.9 11.82,40.62 14.48,40.62 15.27,41.4 15.27,44.1

### Text on the board
tNames: GND | CHG | RESET | 3V3 | VBAT | VUSB | SmartBadge rev B | iotfablab.eu c/o BIBA - Bremer Institut für Produktion und Logistik GmbH